# Altium schematic sheet fpga_bank35.SchDoc: FPGA Bank 35
size A4; Organization: GPA Robotics; Revision: REV 0
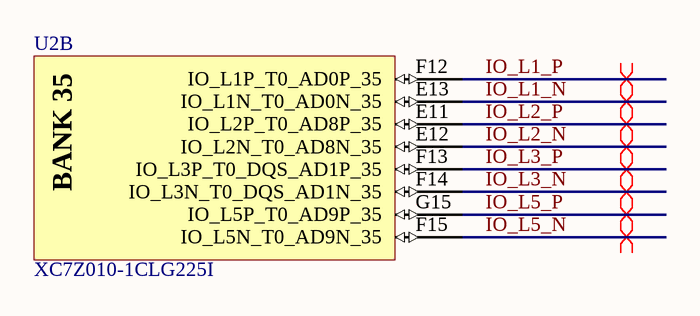
[diagram p0: fpga_bank35.SchDoc]

## Parts
U2  XC7Z010-1CLG225I  [CLG225]  (part B of 8)

## Nets
IO_L1_N: U2.E13(IO_L1N_T0_AD0N_35)
IO_L1_P: U2.F12(IO_L1P_T0_AD0P_35)
IO_L2_N: U2.E12(IO_L2N_T0_AD8N_35)
IO_L2_P: U2.E11(IO_L2P_T0_AD8P_35)
IO_L3_N: U2.F14(IO_L3N_T0_DQS_AD1N_35)
IO_L3_P: U2.F13(IO_L3P_T0_DQS_AD1P_35)
IO_L5_N: U2.F15(IO_L5N_T0_AD9N_35)
IO_L5_P: U2.G15(IO_L5P_T0_AD9P_35)

## Layout directives
differential pair: IO_L1_N, IO_L1_P, IO_L2_N, IO_L2_P, IO_L3_N, IO_L3_P, IO_L5_N, IO_L5_P

## Notes on the sheet
- Title
- Size:
- Date:
- A4
- Number:
- Time:
- Revision:
- Sheet
- of
- Repo:
- (in symbol CMP-0382-00001-1, part B) BANK 35

## Library data of the parts
U2 = CMP-0382-00001-1: 667 MHz Zynq™-7000 AP SoC, 88 PS I/O, 54 FPGA I/O, 225-Ball BGA, Speed Grade 1, Industrial Grade, Pb-Free; LUTs: 17600; Extensible Block RAM (# 36Kb Blocks): 240 KB (60); Speed Grade: -1; Flip Flops: 35200; DatasheetVersion: v1.2; ComponentLink4Description: Package File; ComponentLink1URL: http://www.xilinx.com/support/documentation/data_sheets/ds190-Zynq-7000-Overview.pdf; ComponentLink5URL: http://www.xilinx.com/support/documentation/user_guides/ug865-Zynq-7000-Pkg-Pinout.pdf; ComponentLink5Description: Packaging and Pinout; PartNumber: XC7Z010-1CLG225I; PackageVersion: Rev 1.2, 02/2013; ComponentLink3Description: DC and AC Switching Characteristics; ComponentLink2URL: http://www.xilinx.com/support/documentation/user_guides/ug865-Zynq-7000-Pkg-Pinout.pdf; ComponentLink3URL: http://www.xilinx.com/support/documentation/data_sheets/ds187-XC7Z010-XC7Z020-Data-Sheet.pdf; ComponentLink6URL: http://www.xilinx.com/support/documentation/user_guides/ug483_7Series_PCB.pdf; ComponentLink2Description: Package Specification; PackageReference: CLG225; ComponentLink1Description: Datasheet; ComponentLink4URL: http://www.xilinx.com/support/packagefiles/z7packages/xc7z010clg225pkg.txt; Generic Part Number: XC7Z010; ComponentLink6Description: PCB and Layout Guide; Mounting Technology: Surface Mount; PackageDescription: Wire-Bond Chip-Scale BGA, Body 13 x 13 mm, 0.8 mm Pitch; Code_JEDEC: MO-275-HHAC-1; RoHS: Pb-Free